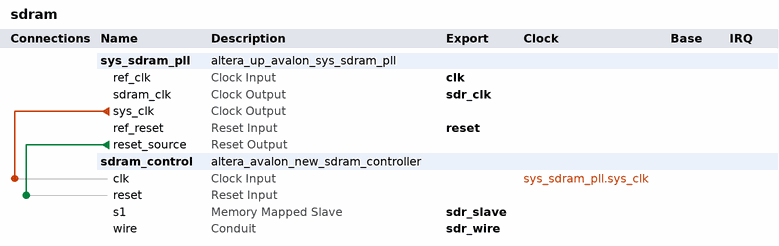
[diagram p0: system contents]
# Platform Designer (Qsys) system sdram, Cyclone V 5CSEMA5F31C6
# Parameters at their usual value, and those the tool derives, are not listed.
package require -exact qsys 18.0
create_system sdram
set_project_property DEVICE_FAMILY {Cyclone V}
set_project_property DEVICE 5CSEMA5F31C6

add_instance sys_sdram_pll altera_up_avalon_sys_sdram_pll 18.0
set_instance_parameter_value sys_sdram_pll CV_boards DE1-SoC
set_instance_parameter_value sys_sdram_pll gui_outclk 50.0
set_instance_parameter_value sys_sdram_pll gui_refclk 50.0

add_instance sdram_control altera_avalon_new_sdram_controller 20.1
set_instance_parameter_value sdram_control TAC 5.4
set_instance_parameter_value sdram_control TRCD 15.0
set_instance_parameter_value sdram_control TRP 15.0
set_instance_parameter_value sdram_control casLatency 3
set_instance_parameter_value sdram_control columnWidth 10
set_instance_parameter_value sdram_control dataWidth 16
set_instance_parameter_value sdram_control generateSimulationModel false
set_instance_parameter_value sdram_control model single_Micron_MT48LC4M32B2_7_chip
set_instance_parameter_value sdram_control numberOfBanks 4
set_instance_parameter_value sdram_control numberOfChipSelects 1
set_instance_parameter_value sdram_control powerUpDelay 100.0
set_instance_parameter_value sdram_control refreshPeriod 7.8125
set_instance_parameter_value sdram_control rowWidth 13

# connections
add_connection sys_sdram_pll.sys_clk sdram_control.clk clock
add_connection sys_sdram_pll.reset_source sdram_control.reset reset

# exported interfaces
add_interface clk clock sink
set_interface_property clk EXPORT_OF sys_sdram_pll.ref_clk
add_interface reset reset sink
set_interface_property reset EXPORT_OF sys_sdram_pll.ref_reset
add_interface sdr_clk clock source
set_interface_property sdr_clk EXPORT_OF sys_sdram_pll.sdram_clk
add_interface sdr_slave avalon slave
set_interface_property sdr_slave EXPORT_OF sdram_control.s1
add_interface sdr_wire conduit end
set_interface_property sdr_wire EXPORT_OF sdram_control.wire

set_interconnect_requirement {$system} qsys_mm.clockCrossingAdapter HANDSHAKE
set_interconnect_requirement {$system} qsys_mm.enableEccProtection FALSE
set_interconnect_requirement {$system} qsys_mm.insertDefaultSlave FALSE
set_interconnect_requirement {$system} qsys_mm.maxAdditionalLatency 1

save_system sdram.qsys
